# Altium schematic sheet Bluetooth Receiver.SchDoc
size A; SheetNumber: 1; SheetTotal: 2; SPICEModelCacheNJVGWOYS: <root> / <DocumentId>NJVGWOYS</DocumentId> / <CacheFrame Number="0"> / <Model Name="cap" Kind="MDL"> / <Text>*Default semiconductor capacitor / .MODEL CAP C()</Text> / </Model> / </CacheFrame> / </root>
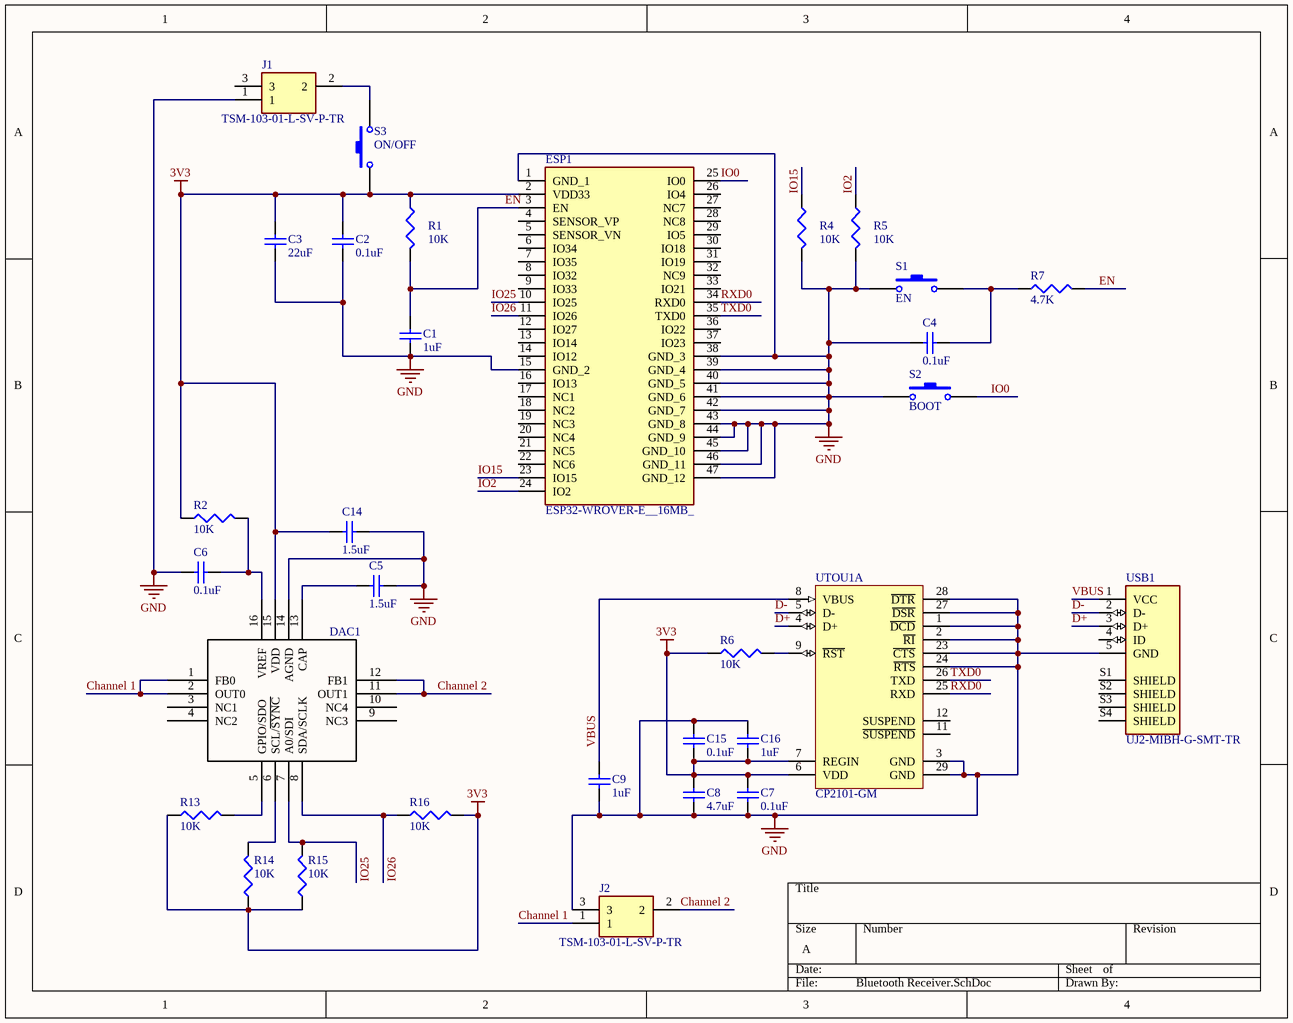
[diagram p0: Bluetooth Receiver.SchDoc]

## Parts
C1  value 1uF  [1608[0603]]  (hidden comment: Cap)
C2  value 0.1uF  [1608[0603]]  (hidden comment: Cap)
C3  value 22uF  [1608[0603]]  (hidden comment: Cap)
C4  value 0.1uF  [1608[0603]]  (hidden comment: Cap)
C5  value 1.5uF  [1608[0603]]  (hidden comment: Cap)
C6  value 0.1uF  [1608[0603]]  (hidden comment: Cap)
C7  value 0.1uF  [1608[0603]]  (hidden comment: Cap)
C8  value 4.7uF  [1608[0603]]  (hidden comment: Cap)
C9  value 1uF  [1608[0603]]  (hidden comment: Cap)
C14  value 1.5uF  [1608[0603]]  (hidden comment: Cap)
C15  value 0.1uF  [1608[0603]]  (hidden comment: Cap)
C16  value 1uF  [1608[0603]]  (hidden comment: Cap)
DAC1  DAC6320  [DAC63202]  (value not drawn)
ESP1  ESP32-WROVER-E__16MB_  [ESP32WROVERE16MB]
J1  TSM-103-01-L-SV-P-TR  [TSM10301LSVPTR]
J2  TSM-103-01-L-SV-P-TR  [TSM10301LSVPTR]
R1  value 10K  [J1-0603]  (hidden comment: Res3)
R2  value 10K  [J1-0603]  (hidden comment: Res3)
R4  value 10K  [J1-0603]  (hidden comment: Res3)
R5  value 10K  [J1-0603]  (hidden comment: Res3)
R6  value 10K  [J1-0603]  (hidden comment: Res3)
R7  value 4.7K  [J1-0603]  (hidden comment: Res3)
R13  value 10K  [J1-0603]  (hidden comment: Res3)
R14  value 10K  [J1-0603]  (hidden comment: Res3)
R15  value 10K  [J1-0603]  (hidden comment: Res3)
R16  value 10K  [J1-0603]  (hidden comment: Res3)
S1  EN  [R1966ABLKBLKEF]
S2  BOOT  [R1966ABLKBLKEF]
S3  ON/OFF  [R1966ABLKBLKEF]
USB1  UJ2-MIBH-G-SMT-TR  [CUI_UJ2-MIBH-G-SMT-TR]
UTOU1  CP2101-GM  [SLAB-QFN-28-3125x3125TP_A_N]  (part A of 2)

## Nets
3V3: C2.2 C3.2 C7.2 C8.2 C14.2 C15.1 C16.1 DAC1.15(VDD) ESP1.2(VDD33) R1.1 R2.1 R6.1 R13.1 R14.1 R15.1 R16.2 S3.1 UTOU1.6(VDD) UTOU1.7(REGIN)
GND: C1.1 C2.1 C3.1 C4.2 C5.1 C6.2 C7.1 C8.1 C9.1 C14.1 C15.2 C16.2 DAC1.14(AGND) ESP1.1(GND_1) ESP1.15(GND_2) ESP1.38(GND_3) ESP1.39(GND_4) ESP1.40(GND_5) ESP1.41(GND_6) ESP1.42(GND_7) ESP1.43(GND_8) ESP1.44(GND_9) ESP1.45(GND_10) ESP1.46(GND_11) ESP1.47(GND_12) J1.1 J2.3 R4.2 R5.2 S1.1 S2.1 USB1.5(GND) UTOU1.1(~{DCD}) UTOU1.2(~{RI}) UTOU1.3(GND) UTOU1.23(~{CTS}) UTOU1.24(~{RTS}) UTOU1.27(~{DSR}) UTOU1.28(~{DTR}) UTOU1.29(GND)
Channel 1: DAC1.1(FB0) DAC1.2(OUT0) J2.1
Channel 2: DAC1.11(OUT1) DAC1.12(FB1) J2.2
D+: USB1.3(D+) UTOU1.4(D+)
D-: USB1.2(D-) UTOU1.5(D-)
EN: C1.2 ESP1.3(EN) R1.2 R7.2
IO0: ESP1.25(IO0) S2.2
IO2: ESP1.24(IO2) R5.1
IO15: ESP1.23(IO15) R4.1
IO25: DAC1.7(A0/SDI) ESP1.10(IO25) R15.2
IO26: DAC1.8(SDA/SCLK) ESP1.11(IO26) R16.1
RXD0: ESP1.34(RXD0) UTOU1.25(RXD)
TXD0: ESP1.35(TXD0) UTOU1.26(TXD)
VBUS: C9.2 USB1.1(VCC) UTOU1.8(VBUS)
NetC4_1: C4.1 R7.1 S1.2
NetC5_2: C5.2 DAC1.13(CAP)
NetC6_1: C6.1 DAC1.16(VREF) R2.2
NetDAC1_5: DAC1.5(GPIO/SDO) R13.2
NetDAC1_6: DAC1.6(SCL/~{SYNC}) R14.2
NetJ1_2: J1.2 S3.2
NetR6_2: R6.2 UTOU1.9(~{RST})

Not connected (* = marked no-connect by the designer): DAC1 3(NC1) 4(NC2) 9(NC3) 10(NC4); ESP1 4(SENSOR_VP) 5(SENSOR_VN) 6(IO34) 7(IO35) 8(IO32) 9(IO33) 12(IO27) 13(IO14) 14(IO12) 16(IO13) 17(NC1) 18(NC2) 19(NC3) 20(NC4) 21(NC5) 22(NC6) 26(IO4) 27(NC7) 28(NC8) 29(IO5) 30(IO18) 31(IO19) 32(NC9) 33(IO21) 36(IO22) 37(IO23); J1 3; USB1 4(ID) S1(SHIELD) S2(SHIELD) S3(SHIELD) S4(SHIELD); UTOU1 11(~{SUSPEND}) 12(SUSPEND)

## Library data of the parts
C1-C9 C14-C16 = Cap Semi: Capacitor (Semiconductor SIM Model); Published: 8-Jun-2000; LatestRevisionDate: 29-May-2009; LatestRevisionNote: IPC-7351 Footprint Added.; PackageReference: C1206; Publisher: Altium Limited; PackageDescription: Chip Capacitor
ESP1 = ESP32-WROVER-E__16MB_: Integrated Circuit; Manufacturer_Name: Espressif Systems; Manufacturer_Part_Number: ESP32-WROVER-E (16MB); Datasheet Link: https://www.espressif.com/sites/default/files/documentation/esp32-wrover_datasheet_en.pdf; Height: 3.4mm; Mouser Part Number: 356-ESP32WRVE22864PC; Mouser Price/Stock: https://www.mouser.co.uk/ProductDetail/Espressif-Systems/ESP32-WROVER-E-16MB?qs=GBLSl2Akirv1e4kp%252BlJr4g%3D%3D
J1 J2 = TSM-103-01-L-SV-P-TR: Connector; Manufacturer_Name: SAMTEC; Datasheet Link: https://datasheet.datasheetarchive.com/originals/dk/DKDS40/DSANUWW0019078.pdf; Manufacturer_Part_Number: TSM-103-01-L-SV-P-TR; Mouser Part Number: 200-TSM10301LSVPTR; Mouser Price/Stock: https://www.mouser.co.uk/ProductDetail/Samtec/TSM-103-01-L-SV-P-TR?qs=DZ6FV2pdG5tjRaLOEfFPgw%3D%3D; Arrow Part Number: TSM-103-01-L-SV-P-TR; Arrow Price/Stock: https://www.arrow.com/en/products/tsm-103-01-l-sv-p-tr/samtec?region=europe
R1 R2 R4-R7 R13-R16 = Res3: Resistor; Published: 8-Jun-2000; LatestRevisionDate: 29-May-2009; LatestRevisionNote: IPC-7351 Footprint Added.; PackageReference: J1-0603; Publisher: Altium Limited; PackageDescription: Chip Resistor
S1-S3 = SW-PB: Switch; Published: 24-Mar-1999; LatestRevisionDate: 17-Jul-2002; LatestRevisionNote: Re-released for DXP Platform.; PackageReference: SPST-2; Publisher: Altium Limited; PackageDescription: Switch; 2 Leads
USB1 = UJ2-MIBH-G-SMT-TR: USB micro B type receptacle; Price: None; Value: *; Package: None; Availability: Unavailable; MP: UJ2-MIBH-G-SMT-TR
UTOU1 = CP2101-GM: Single-Chip USB to UART Bridge, 512 Bytes EEPROM, -40 to 85 degC, 28-pin QFN, Tube; Manufacturer: Silicon Labs; Sub-Family: USB Bridges; Internal Oscillator: TRUE; ComponentLink1Description: Manufacturer URL; ComponentLink2Description: Datasheet; ComponentLink3Description: Package Specification; ComponentLink3URL: http://www.silabs.com/Support%20Documents/TechnicalDocs/C8051F35x.pdf; DatasheetVersion: Rev. 1.8; ComponentLink1URL: http://www.silabs.com/; ComponentLink2URL: http://www.silabs.com/Support%20Documents/TechnicalDocs/CP2101.pdf; Mounting Technology: Surface Mount; PackageDescription: 28-Pin Quad-Flat No-Leads Package, Body 5 x 5 mm, Pitch 0.5 mm; PartNumber: CP2101-GM; EEPROM: 512 Bytes; PackageReference: QFN-28